# EAGLE design RelayDelayTiny (EAGLE 7.2.0)
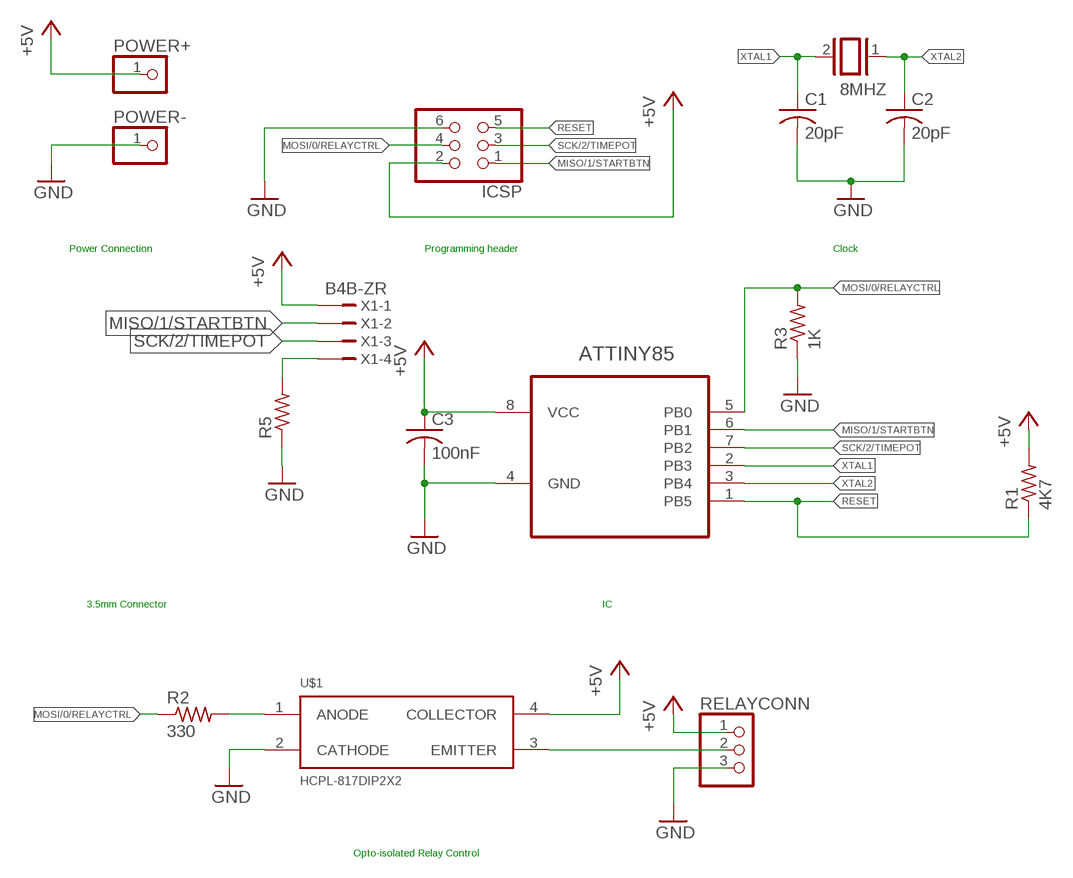
[diagram p0: schematic, sheet 1]

## Parts
8MHZ  XTAL/S  [QS]
ATTINY85  ATTINY85-20SU  [SOIC127P798X216-8N]
C1  20pF  C-USC0805  [C0805]
C2  20pF  C-USC0805  [C0805]
C3  100nF  C-USC0805  [C0805]
ICSP  PINHD-2X3  [2X03]
POWER+  PINHD-1X1  [1X01]
POWER-  PINHD-1X1  [1X01]
R1  4K7  R-US_R0805  [R0805]
R2  330  R-US_M0805  [M0805]
R3  1K  R-US_M0805  [M0805]
R5  R-US_R0805  [R0805]
RELAYCONN  PINHD-1X3  [1X03]
U$1  HCPL-817DIP2X2  [DIP]
X1  B4B-ZR  [B4B-ZR]

## Nets
+5V: ATTINY85.8(VCC) C3.1 ICSP.2 POWER+.1 R1.2 RELAYCONN.1 U$1.4(COLLECTOR) X1.1
GND: ATTINY85.4(GND) C1.2 C2.2 C3.2 ICSP.6 POWER-.1 R3.1 R5.1 RELAYCONN.3 U$1.2(CATHODE)
MISO/1/STARTBTN: ATTINY85.6(PB1) ICSP.1 X1.2
MOSI/0/RELAYCTRL: ATTINY85.5(PB0) ICSP.4 R2.1 R3.2
N$1: RELAYCONN.2 U$1.3(EMITTER)
N$2: R2.2 U$1.1(ANODE)
N$4: R5.2 X1.4
RESET: ATTINY85.1(PB5) ICSP.5 R1.1
SCK/2/TIMEPOT: ATTINY85.7(PB2) ICSP.3 X1.3
XTAL1: 8MHZ.2 ATTINY85.2(PB3) C1.1
XTAL2: 8MHZ.1 ATTINY85.3(PB4) C2.1

## Notes on the sheet
- Power Connection | Programming header | Clock
- 3.5mm Connector | IC
- Opto-isolated Relay Control

## Library data of the parts
8MHZ = special:XTAL/S: CRYSTAL
ATTINY85 = Atmel_By_element14_Batch_1-00:ATTINY85-20SU: 8-bit Microcontroller with In-System Programmable Flash; MPN: ATTINY85-20SU; OC_FARNELL: 1455164; OC_NEWARK: 58M3797; PACKAGE: SOIC-8; SUPPLIER: Atmel
C1-C3 = resistor:C-US: CAPACITOR, American symbol
ICSP = pinhead:PINHD-2X3: PIN HEADER
POWER+ POWER- = adafruit:PINHD-1X1: Pin header 1x1 for 0.1" spacing With round pins
R1-R3 = resistor:R-US_: RESISTOR, American symbol
R5 = rcl:R-US_: RESISTOR, American symbol
RELAYCONN = adafruit:PINHD-1X3: PIN HEADER
U$1 = OptoIsolator HCPL-817:HCPL-817: The HCPL-817 contains a light emitting diode optically coupled to a phototransistor. It is packaged in a 4-pin DIP package and available in wide-lead spacing option and lead bend SMD option. Input-output isolation voltage is 5000 Vrms. Response time, tr, is typically 4 μs and minimum CTR is 50% at input current of 5 mA.
X1 = con-jst:?4B-ZR: ZH CONNECTOR 1.5 mm, 4 pin 1 row Source: http://www.jst.com .. eZH.pdf; MF: FARNELL; MPN: B4B-ZR(LF)(SN); OC_FARNELL: 1830916; OC_NEWARK: 37K9960

## Board
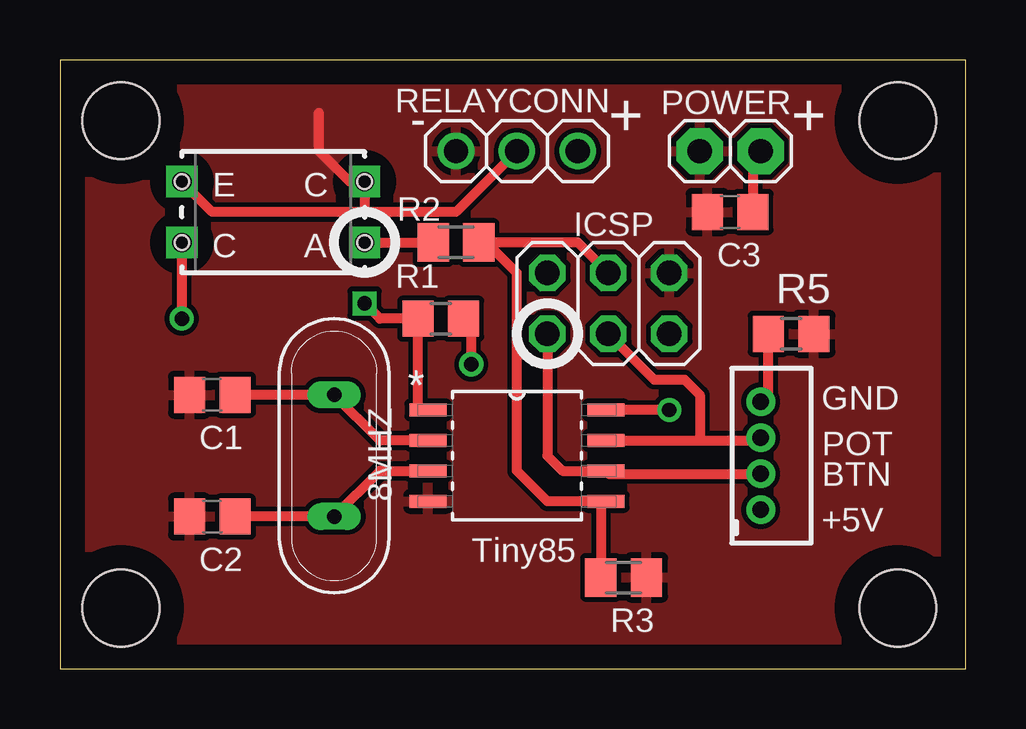
[diagram p1: board, top side]
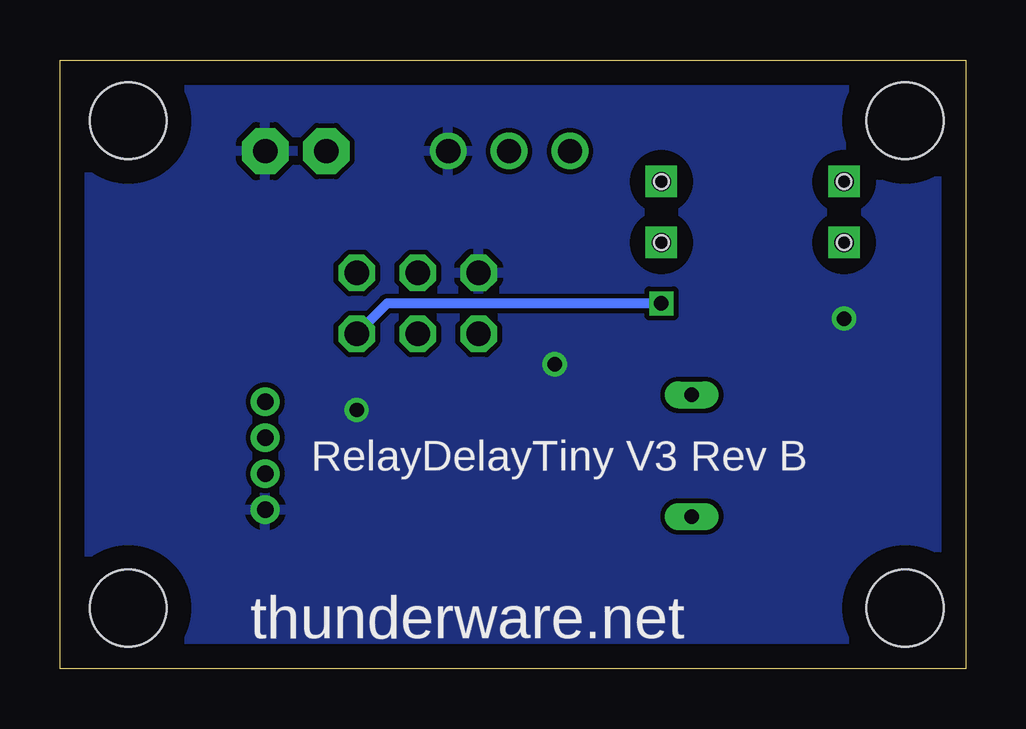
[diagram p2: board, bottom side, seen from below]

Size 37.77 x 25.39 mm. Coordinates in mm from the lower left corner, seen from the top.
Outline: 0,0 37.77,0 37.77,25.39 0,25.39 0,0
Copper layers (1*16): Top 0.035mm / dielectric 1.5mm / Bottom 0.035mm
Design rules "default": minimum track width 10mil, minimum drill 24mil, track to track 8mil, track to pad 8mil, pad to pad 8mil, via to via 8mil, smd to smd 8mil, copper to edge 40mil, drill to drill 8mil, minimum pad ring 10mil, minimum via ring 8mil, stop-mask expansion 4mil, vias tented up to drill 0mil, thermal gap 10mil
Holes 3.2 mm at 2.54,2.54 34.92,2.54 34.92,22.86 2.54,22.86

### Footprints (pad centres in the part's own frame; a part is rotated, then mirrored left to right if it is on the bottom)
QS = drill 0.61 long: 1 -2.54,0; 2 2.54,0
SOIC127P798X216-8N = smd 1.549 x 0.533: 1 -3.708,1.905; 2 -3.708,0.635; 3 -3.708,-0.635; 4 -3.708,-1.905; 5 3.708,-1.905; 6 3.708,-0.635; 7 3.708,0.635; 8 3.708,1.905
C0805 = smd 1.3 x 1.5: 1 -0.95,0; 2 0.95,0
2X03 = drill 1.016 octagon: 1 -2.54,-1.27; 2 -2.54,1.27; 3 0,-1.27; 4 0,1.27; 5 2.54,-1.27; 6 2.54,1.27
1X01 = drill 1.016 pad 1.93 octagon: 1 0,0
R0805 = smd 1.3 x 1.5: 1 -0.95,0; 2 0.95,0
M0805 = smd 1.3 x 1.6: 1 -0.95,0; 2 0.95,0
1X03 = drill 1.016: 1 -2.54,0; 2 0,0; 3 2.54,0
DIP = drill 0.8 square: 1 -3.81,1.27; 2 -3.81,-1.27; 3 3.81,-1.27; 4 3.81,1.27 | hole 0.6: -3.81,1.27; -3.81,-1.27; 3.81,-1.27; 3.81,1.27
B4B-ZR = drill 0.7 pad 1.1: 1 -2.25,0; 2 -0.75,0; 3 0.75,0; 4 2.25,0

### Placement (x,y rotation side)
8MHZ  11.43,8.89 90 top
ATTINY85  19.05,8.89 0 top
C1  6.35,11.43 180 top
C2  6.35,6.35 180 top
C3  27.94,19.05 180 top
ICSP  22.86,15.24 0 top
POWER+  29.21,21.59 0 top
POWER-  26.67,21.59 0 top
R1  15.88,14.61 0 top
R2  16.51,17.78 180 top
R3  23.5,3.81 180 top
R5  30.48,13.97 180 top
RELAYCONN  19.05,21.59 180 top
U$1  8.89,19.05 180 top
X1  29.21,8.89 90 top

### Tracks (layer width: path | path; a pad name or v marks a point on that pad's centre or on a via)
+5V  (via drill 0.6)
  Top 0.406: v25.4,10.79 ATTINY85.8 | R1.2 17.14,14.61 v17.14,12.7 | U$1.4 v5.08,14.61 | POWER+.1 28.89,21.27 C3.1
  pour Bottom: 0,25.4 0,0 37.47,0 37.47,25.4
GND
  Top 0.406: 10.79,23.18 10.79,21.59 12.06,20.32 U$1.2 12.7,19.05
  pour Top: 0,25.4 0,0 37.47,0 37.47,25.4
MISO/1/STARTBTN
  Top 0.406: ICSP.1 20.32,8.89 20.95,8.26 ATTINY85.6 22.87,8.14 X1.2
MOSI/0/RELAYCTRL
  Top 0.406: R3.2 22.55,6.99 ATTINY85.5 20.32,6.99 19.05,8.26 19.05,16.51 17.78,17.78 R2.1 21.59,17.78 ICSP.4
N$1
  Top 0.406: RELAYCONN.2 16.51,19.05 6.35,19.05 U$1.3
N$2
  Top 0.406: U$1.1 R2.2
N$4
  Top 0.406: X1.4 29.53,11.46 R5.2
RESET  (via drill 0.6)
  Top 0.406: ATTINY85.1 14.93,10.79 R1.1 13.34,14.61 v12.7,15.24
  Bottom 0.406: v12.7,15.24 24.13,15.24 ICSP.5
SCK/2/TIMEPOT
  Top 0.406: ATTINY85.7 26.67,9.53 | 26.67,9.53 29.21,9.53 X1.3 | ICSP.3 24.77,12.06 26.04,12.06 26.67,11.43 26.67,9.53
XTAL1
  Top 0.406: C1.1 8MHZ.2 13.34,9.53 ATTINY85.2
XTAL2
  Top 0.406: C2.1 8MHZ.1 13.34,8.26 ATTINY85.3

### Text on the board
tPlace: POWER | - | + | + | E | C | C | A
tNames: R1 | GND | POT | BTN | +5V | Tiny85
bNames: RelayDelayTiny V3 Rev B | thunderware.net